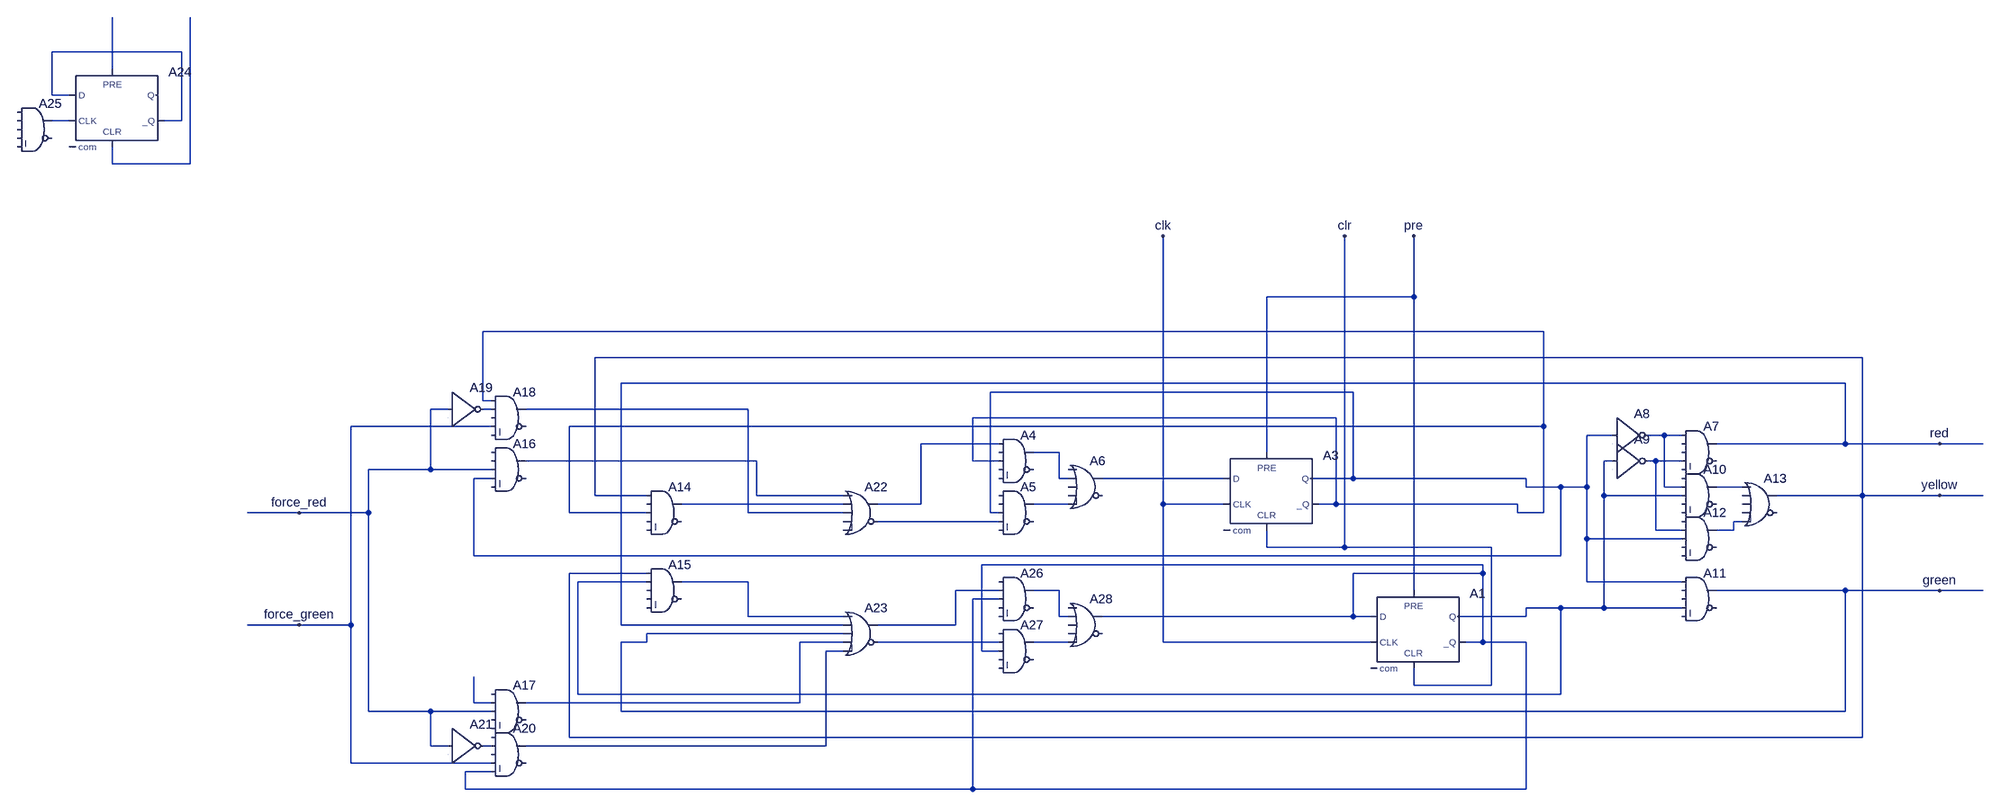
[diagram p0: schematic second_task_test.asc]
second_task_test.asc, the LTspice schematic file:
Version 4
SHEET 1 2084 680
WIRE -1584 -768 -1824 -768
WIRE -1712 -736 -1712 -832
WIRE -1824 -688 -1824 -768
WIRE -1792 -688 -1824 -688
WIRE -1792 -640 -1824 -640
WIRE -1584 -640 -1584 -768
WIRE -1584 -640 -1616 -640
WIRE -1712 -560 -1712 -592
WIRE -1568 -560 -1568 -832
WIRE -1568 -560 -1712 -560
WIRE 880 -240 880 -368
WIRE 880 -240 608 -240
WIRE 1120 -176 -880 -176
WIRE 1712 -128 -672 -128
WIRE 1680 -80 -624 -80
WIRE 768 -64 96 -64
WIRE -880 -48 -880 -176
WIRE -864 -48 -880 -48
WIRE -944 -32 -976 -32
WIRE -864 -32 -880 -32
WIRE -352 -32 -800 -32
WIRE 736 -16 64 -16
WIRE -864 0 -1152 0
WIRE 1120 0 1120 -176
WIRE 1120 0 -720 0
WIRE 1248 16 1200 16
WIRE 1344 16 1312 16
WIRE 1376 16 1344 16
WIRE 112 32 -32 32
WIRE 1680 32 1680 -80
WIRE 1680 32 1440 32
WIRE 2000 32 1680 32
WIRE 2080 32 2000 32
WIRE 224 48 176 48
WIRE 608 48 608 -240
WIRE -336 64 -800 64
WIRE 64 64 64 -16
WIRE 112 64 64 64
WIRE 1248 64 1232 64
WIRE 1328 64 1312 64
WIRE 1376 64 1328 64
WIRE -976 80 -976 -32
WIRE -976 80 -1120 80
WIRE -864 80 -976 80
WIRE -864 96 -896 96
WIRE 224 96 224 48
WIRE 240 96 224 96
WIRE 528 96 304 96
WIRE 768 96 768 -64
WIRE 768 96 688 96
WIRE 1088 96 768 96
WIRE 1088 112 1088 96
WIRE 1152 112 1088 112
WIRE 1200 112 1200 16
WIRE 1200 112 1152 112
WIRE 1344 112 1344 16
WIRE 1376 112 1344 112
WIRE 1488 112 1440 112
WIRE -672 128 -672 -128
WIRE -576 128 -672 128
WIRE -336 128 -336 64
WIRE -176 128 -336 128
WIRE 1232 128 1232 64
WIRE 1376 128 1232 128
WIRE 1712 128 1712 -128
WIRE 1712 128 1552 128
WIRE 2000 128 1712 128
WIRE 2080 128 2000 128
WIRE -176 144 -512 144
WIRE -32 144 -32 32
WIRE -32 144 -112 144
WIRE 240 144 176 144
WIRE 416 144 416 -368
WIRE 528 144 416 144
WIRE 736 144 736 -16
WIRE 736 144 704 144
WIRE 1072 144 736 144
WIRE -1248 160 -1344 160
WIRE -1120 160 -1120 80
WIRE -1120 160 -1248 160
WIRE -720 160 -720 0
WIRE -576 160 -720 160
WIRE -352 160 -352 -32
WIRE -176 160 -352 160
WIRE 96 160 96 -64
WIRE 112 160 96 160
WIRE 1072 160 1072 144
WIRE 1120 160 1120 0
WIRE 1120 160 1072 160
WIRE 112 176 -112 176
WIRE 1488 176 1472 176
WIRE 1328 192 1328 64
WIRE 1376 192 1328 192
WIRE 1472 192 1472 176
WIRE 1472 192 1440 192
WIRE 1200 208 1200 112
WIRE 1376 208 1200 208
WIRE 608 224 608 192
WIRE 752 224 752 -368
WIRE 752 224 608 224
WIRE 1024 224 752 224
WIRE -896 240 -896 96
WIRE 1152 240 1152 112
WIRE 1152 240 -896 240
WIRE 1008 256 80 256
WIRE -576 272 -720 272
WIRE 1008 272 1008 256
WIRE 1008 272 768 272
WIRE -576 288 -704 288
WIRE -352 288 -512 288
WIRE 1200 288 1200 208
WIRE 1376 288 1200 288
WIRE 112 304 32 304
WIRE 224 304 176 304
WIRE 880 304 880 -240
WIRE 1680 304 1440 304
WIRE 2000 304 1680 304
WIRE 2080 304 2000 304
WIRE 112 320 64 320
WIRE 1152 336 1088 336
WIRE 1232 336 1232 128
WIRE 1232 336 1152 336
WIRE 1376 336 1232 336
WIRE -352 352 -352 288
WIRE -176 352 -352 352
WIRE 224 352 224 304
WIRE 240 352 224 352
WIRE 768 352 768 272
WIRE 768 352 304 352
WIRE 800 352 768 352
WIRE 1088 352 1088 336
WIRE 1088 352 960 352
WIRE -1248 368 -1344 368
WIRE -1152 368 -1152 0
WIRE -1152 368 -1248 368
WIRE -624 368 -624 -80
WIRE -176 368 -624 368
WIRE 32 368 32 304
WIRE 32 368 -112 368
WIRE -176 384 -576 384
WIRE -576 400 -576 384
WIRE -576 400 -624 400
WIRE -176 400 -256 400
WIRE 112 400 -112 400
WIRE 240 400 176 400
WIRE 416 400 416 144
WIRE 800 400 416 400
WIRE 1008 400 1008 272
WIRE 1008 400 976 400
WIRE 1088 400 1008 400
WIRE -176 416 -208 416
WIRE 80 416 80 256
WIRE 112 416 80 416
WIRE 880 480 880 448
WIRE 1024 480 1024 224
WIRE 1024 480 880 480
WIRE -704 496 -704 288
WIRE 1152 496 1152 336
WIRE 1152 496 -704 496
WIRE -896 512 -896 464
WIRE -864 512 -896 512
WIRE -256 512 -256 400
WIRE -256 512 -800 512
WIRE -1120 528 -1120 160
WIRE -976 528 -1120 528
WIRE -864 528 -976 528
WIRE -624 528 -624 400
WIRE 1680 528 1680 304
WIRE 1680 528 -624 528
WIRE -720 576 -720 272
WIRE 1712 576 1712 128
WIRE 1712 576 -720 576
WIRE -976 592 -976 528
WIRE -944 592 -976 592
WIRE -864 592 -880 592
WIRE -208 592 -208 416
WIRE -208 592 -800 592
WIRE -1152 624 -1152 368
WIRE -864 624 -1152 624
WIRE -864 640 -912 640
WIRE -912 672 -912 640
WIRE 64 672 64 320
WIRE 64 672 -912 672
WIRE 1088 672 1088 400
WIRE 1088 672 64 672
FLAG 2000 32 red
FLAG 2000 304 green
FLAG 2000 128 yellow
FLAG -1248 160 force_red
FLAG -1248 368 force_green
FLAG 416 -368 clk
FLAG 880 -368 pre
FLAG 752 -368 clr
SYMBOL Digital\\and 1408 -16 R0
SYMATTR InstName A7
SYMBOL Digital\\inv 1248 -48 R0
SYMATTR InstName A8
SYMBOL Digital\\inv 1248 0 R0
SYMATTR InstName A9
SYMBOL Digital\\and 1408 256 R0
SYMATTR InstName A11
SYMBOL Digital\\and 1408 64 R0
SYMATTR InstName A10
SYMBOL Digital\\and 1408 144 R0
SYMATTR InstName A12
SYMBOL Digital\\or 1520 80 R0
SYMATTR InstName A13
SYMBOL Digital\\and -544 96 R0
SYMATTR InstName A14
SYMBOL Digital\\and -544 240 R0
SYMATTR InstName A15
SYMBOL Digital\\and -832 16 R0
SYMATTR InstName A16
SYMBOL Digital\\and -832 464 R0
SYMATTR InstName A17
SYMBOL Digital\\and -832 -80 R0
SYMATTR InstName A18
SYMBOL Digital\\inv -944 -96 R0
SYMATTR InstName A19
SYMBOL Digital\\and -832 544 R0
SYMATTR InstName A20
SYMBOL Digital\\inv -944 528 R0
SYMATTR InstName A21
SYMBOL Digital\\or -144 96 R0
SYMATTR InstName A22
SYMBOL Digital\\or -144 320 R0
SYMATTR InstName A23
SYMBOL Digital\\dflop -1712 -736 R0
SYMATTR InstName A24
SYMBOL Digital\\and -1856 -688 R0
SYMATTR InstName A25
SYMBOL Digital\\dflop 880 304 R0
SYMATTR InstName A1
SYMBOL Digital\\dflop 608 48 R0
SYMATTR InstName A3
SYMBOL Digital\\and 144 0 R0
SYMATTR InstName A4
SYMBOL Digital\\and 144 96 R0
SYMATTR InstName A5
SYMBOL Digital\\or 272 48 R0
SYMATTR InstName A6
SYMBOL Digital\\and 144 256 R0
SYMATTR InstName A26
SYMBOL Digital\\and 144 352 R0
SYMATTR InstName A27
SYMBOL Digital\\or 272 304 R0
SYMATTR InstName A28

The netlist it stands for:
* second_task_test.asc
A7 N009 0 0 N014 0 0 red 0 AND
A8 N006 0 0 0 0 N009 0 0 BUF
A9 N013 0 0 0 0 N014 0 0 BUF
A11 N006 0 0 N013 0 0 green 0 AND
A10 0 N009 N013 0 0 0 N016 0 AND
A12 0 N014 N006 0 0 0 N020 0 AND
A13 N016 0 0 0 N020 0 yellow 0 OR
A14 yellow 0 N005 0 0 0 N017 0 AND
A15 yellow N013 0 0 0 0 N022 0 AND
A16 0 0 force_red N006 0 0 N012 0 AND
A17 0 N029 force_red 0 0 0 N025 0 AND
A18 N005 N007 0 force_green 0 0 N008 0 AND
A19 force_red 0 0 0 0 N007 0 0 BUF
A20 0 N030 0 force_green N021 0 N028 0 AND
A21 force_red 0 0 0 0 N030 0 0 BUF
A22 N012 N017 N008 0 0 N019 N010 0 OR
A23 N022 red green N025 N028 N026 N023 0 OR
A24 N001 0 N003 N002 N004 N001 0 0 DFLOP
A25 0 0 0 0 0 0 N003 0 AND
A1 N021 0 clk pre clr N021 N013 0 DFLOP
A3 N015 0 clk pre clr N005 N006 0 DFLOP
A4 N010 0 N005 0 0 0 N011 0 AND
A5 0 0 N006 N019 0 0 N018 0 AND
A6 0 N011 0 0 N018 0 N015 0 OR
A26 0 N023 N021 0 0 0 N024 0 AND
A27 0 N026 N021 0 0 0 N027 0 AND
A28 0 N024 0 0 N027 0 N021 0 OR
.backanno
.end